# EAGLE design ProtoPi-v1 (EAGLE 7.3.0)
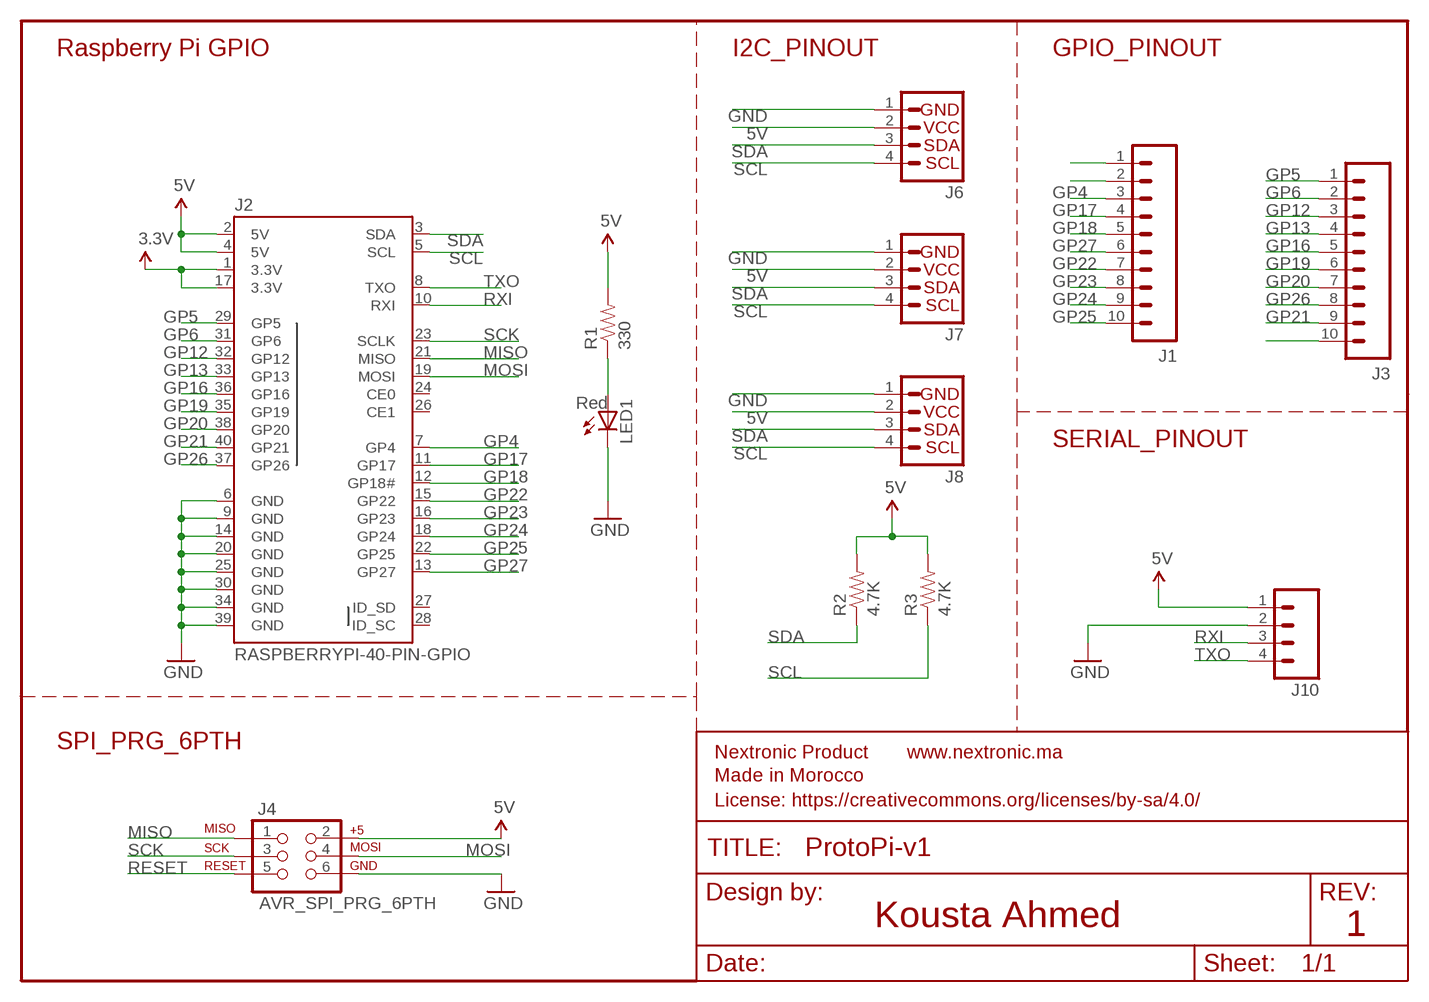
[diagram p0: schematic, sheet 1]

## Parts
FRAME1  FRAME-LETTER  [CREATIVE_COMMONS]
J1  M10SILK_FEMALE_PTH  [1X10]
J2  RASPBERRYPI-40-PIN-GPIO  [2X20-SHROUDED]
J3  M10SILK_FEMALE_PTH  [1X10]
J4  AVR_SPI_PRG_6PTH  [2X3]
J6  I2C_STANDARD  [1X04]
J7  I2C_STANDARD  [1X04]
J8  I2C_STANDARD  [1X04]
J10  M04PTH  [1X04]
LED1  Red  LED5MM  [LED5MM]
R1  330  RESISTORPTH1  [AXIAL-0.3]
R2  4.7K  RESISTORPTH1  [AXIAL-0.3]
R3  4.7K  RESISTORPTH1  [AXIAL-0.3]

## Nets
3.3V: J2.1(3.3V) J2.17(3.3V)
5V: J2.2(5V) J2.4(5V) J4.2 J6.2 J7.2 J8.2 J10.1 R1.P$2 R2.P$2 R3.P$2
GND: J2.6(GND) J2.9(GND) J2.14(GND) J2.20(GND) J2.25(GND) J2.30(GND) J2.34(GND) J2.39(GND) J4.6 J6.1 J7.1 J8.1 J10.2 LED1.K(C)
GP4: J1.3 J2.7(GP4)
GP5: J2.29(GP5) J3.1
GP6: J2.31(GP6) J3.2
GP12: J2.32(GP12) J3.3
GP13: J2.33(GP13) J3.4
GP16: J2.36(GP16) J3.5
GP17: J1.4 J2.11(GP17)
GP18: J1.5 J2.12(GP18#)
GP19: J2.35(GP19) J3.6
GP20: J2.38(GP20) J3.7
GP21: J2.40(GP21) J3.9
GP22: J1.7 J2.15(GP22)
GP23: J1.8 J2.16(GP23)
GP24: J1.9 J2.18(GP24)
GP25: J1.10 J2.22(GP25)
GP26: J2.37(GP26) J3.8
GP27: J1.6 J2.13(GP27)
MISO: J2.21(MISO) J4.1
MOSI: J2.19(MOSI) J4.4
N$4: J1.1
N$5: J1.2
N$126: LED1.A R1.P$1
N$468: J3.10
RESET: J4.5
RXI: J2.10(RXI) J10.3
SCK: J2.23(SCLK) J4.3
SCL: J2.5(SCL) J6.4 J7.4 J8.4 R3.P$1
SDA: J2.3(SDA) J6.3 J7.3 J8.3 R2.P$1
TXO: J2.8(TXO) J10.4
Unconnected: J2.24(CE0) J2.26(CE1) J2.27(ID_SD) J2.28(ID_SC)

## Notes on the sheet
- Raspberry Pi GPIO | I2C_PINOUT | GPIO_PINOUT
- SERIAL_PINOUT
- SPI_PRG_6PTH
- Kousta Ahmed | 1

## Library data of the parts
FRAME1 = SparkFun-Aesthetics:FRAME-LETTER: Schematic Frame Standard 8.5x11 US Letter frame
J1 J3 = SparkFun-Connectors:M10: Header 10 Standard 10-pin 0.1" header. Use with straight break away headers (SKU : PRT-00116), right angle break away headers (PRT-00553), swiss pins (PRT-00743), machine pins (PRT-00117), and female headers (PRT-00115).; PROD_ID: CONN-11563
J2 = SparkFun-Boards:RASPBERRYPI-40-PIN-GPIO: Second Generation Raspberry Pi GPIO Header 2x20 pin connector, as found on B, B+, A+ models.
J4 = SparkFun-Connectors:AVR_SPI_PRG_6: AVR ISP 6 Pin This is the reduced ISP connector for AVR programming. Common on Arduino. This footprint will take up less PCB space and can be used with a 10-pin to 6-pin adapter such as SKU: BOB-08508 **Special note about "TEST_POINT" package. The stop mask is on the top side, so if you want your programming test points to be on the bottom of your board, make sure to place this package on the bottom side of the board. This also ensure that the orientation to program from the bottom side will be correct.
J6-J8 = SparkFun-Connectors:I2C_STANDARD: SparkFun has standardized on a pinout for all I2C based sensor breakouts. This pinout allows I2C boards to be plugged directly into the headers on Arduino Uno compatible boards, and to be daisy chained easily.
J10 = SparkFun-Connectors:M04: Header 4 Standard 4-pin 0.1" header. Use with straight break away headers (SKU : PRT-00116), right angle break away headers (PRT-00553), swiss pins (PRT-00743), machine pins (PRT-00117), and female headers (PRT-00115). Molex polarized connector foot print use with SKU : PRT-08231 with associated crimp pins and housings. 1MM SMD Version SKU: PRT-10208; PROD_ID: CONN-09696
LED1 = SparkFun:LED: LEDs Standard schematic elements and footprints for 5mm, 3mm, 1206, and 0603 sized LEDs. 5mm - Spark Fun Electronics SKU : COM-00529 (and others)
R1-R3 = SparkFun:RESISTOR: Resistor Basic schematic elements and footprints for 0603, 1206, and PTH 1/10th watt (small) resistors.

## Board
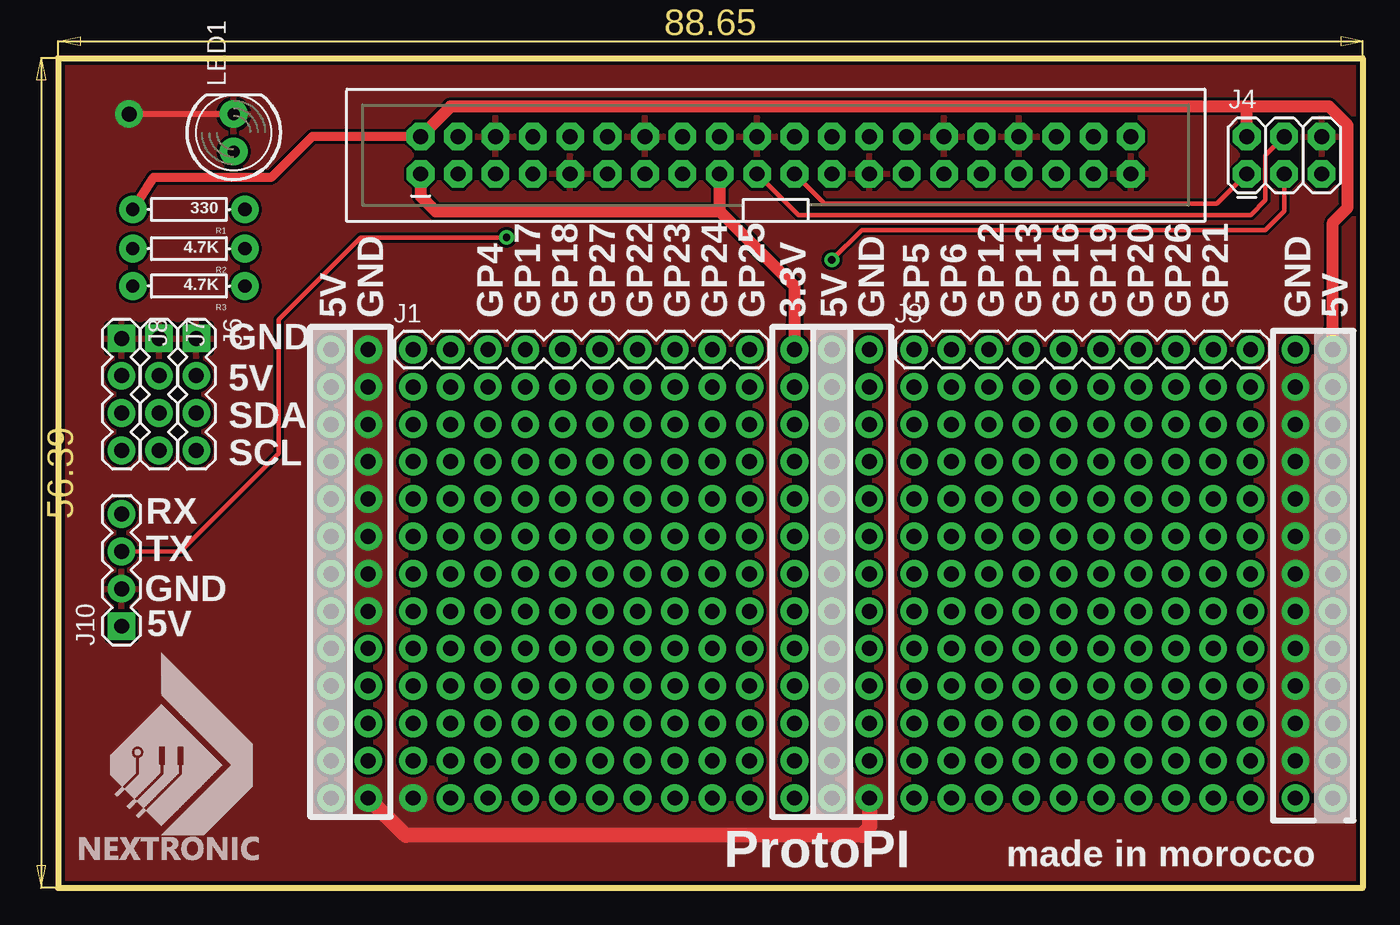
[diagram p1: board, top side]
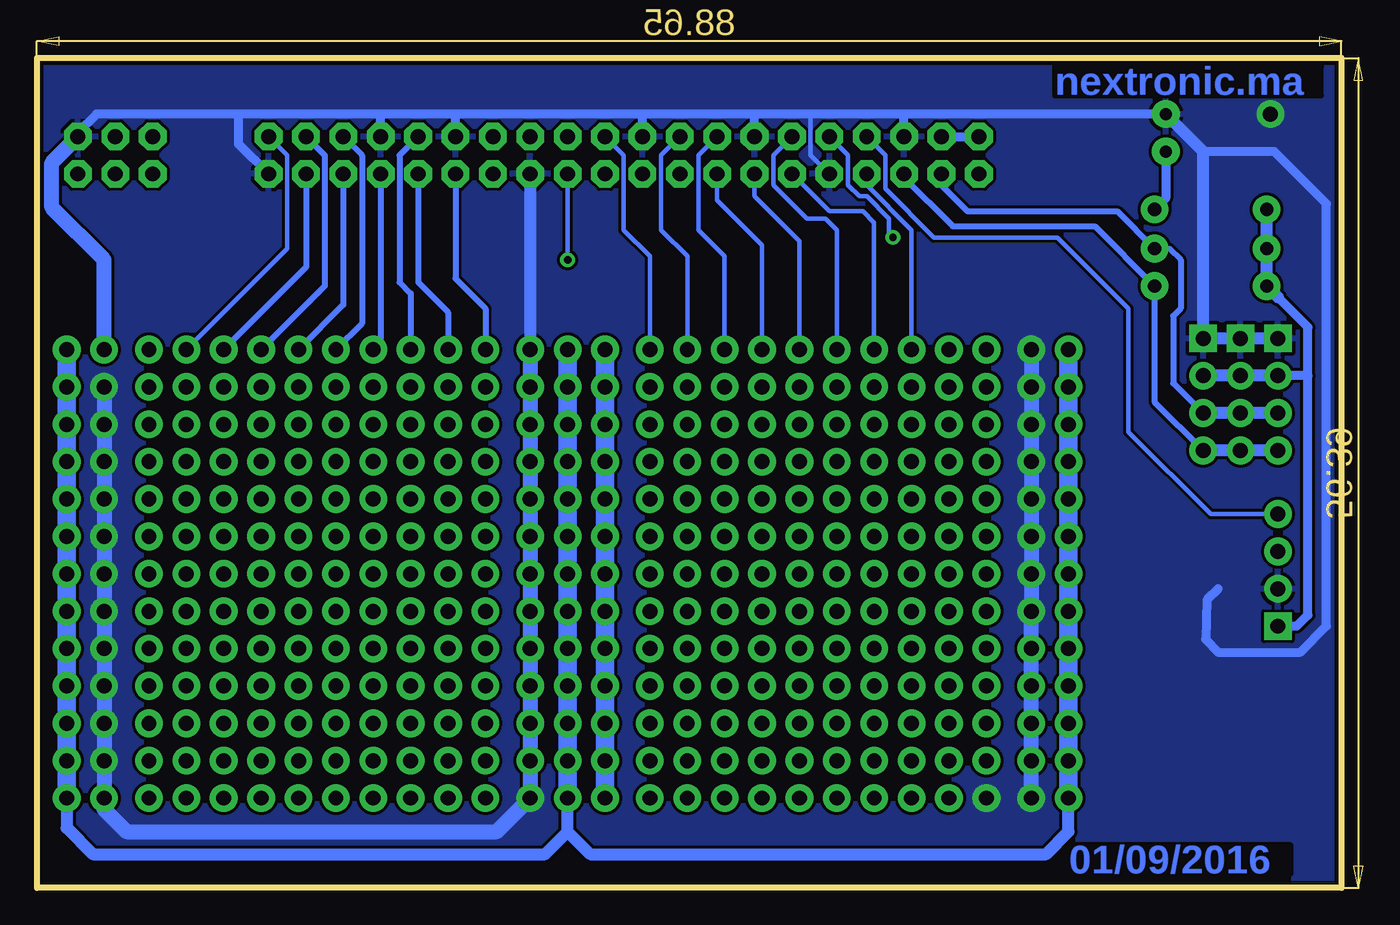
[diagram p2: board, bottom side, seen from below]

Size 88.65 x 56.39 mm. Coordinates in mm from the lower left corner, seen from the top.
Outline: 0,56.39 88.65,56.39 88.65,0 0,0 0,56.39
Copper layers (1*16): Top 0.035mm / dielectric 1.5mm / Bottom 0.035mm
Design rules "SparkFun": minimum track width 8mil, minimum drill 20mil, track to track 8mil, track to pad 8mil, pad to pad 8mil, via to via 8mil, smd to smd 8mil, copper to edge 10mil, drill to drill 8mil, minimum pad ring 12mil, minimum via ring 10mil, stop-mask expansion 4mil, vias tented up to drill 25mil, thermal gap 10mil

### Footprints (pad centres in the part's own frame; a part is rotated, then mirrored left to right if it is on the bottom)
1X10 = drill 1.016 pad 1.88: 1 0,0; 2 2.54,0; 3 5.08,0; 4 7.62,0; 5 10.16,0; 6 12.7,0; 7 15.24,0; 8 17.78,0; 9 20.32,0; 10 22.86,0
2X20-SHROUDED = drill 1.016 pad 1.88 octagon: 1 -1.27,24.13; 2 1.27,24.13; 3 -1.27,21.59; 4 1.27,21.59; 5 -1.27,19.05; 6 1.27,19.05; 7 -1.27,16.51; 8 1.27,16.51; 9 -1.27,13.97; 10 1.27,13.97; 11 -1.27,11.43; 12 1.27,11.43; 13 -1.27,8.89; 14 1.27,8.89; 15 -1.27,6.35; 16 1.27,6.35; 17 -1.27,3.81; 18 1.27,3.81; 19 -1.27,1.27; 20 1.27,1.27; 21 -1.27,-1.27; 22 1.27,-1.27; 23 -1.27,-3.81; 24 1.27,-3.81; 25 -1.27,-6.35; 26 1.27,-6.35; 27 -1.27,-8.89; 28 1.27,-8.89; 29 -1.27,-11.43; 30 1.27,-11.43; 31 -1.27,-13.97; 32 1.27,-13.97; 33 -1.27,-16.51; 34 1.27,-16.51; 35 -1.27,-19.05; 36 1.27,-19.05; 37 -1.27,-21.59; 38 1.27,-21.59; 39 -1.27,-24.13; 40 1.27,-24.13
2X3 = drill 1.016 pad 1.88 octagon: 1 0,0; 2 0,2.54; 3 2.54,0; 4 2.54,2.54; 5 5.08,0; 6 5.08,2.54
1X04 = drill 1.016 pad 1.88 square: 1 0,0 | drill 1.016 pad 1.88: 2 2.54,0; 3 5.08,0; 4 7.62,0
LED5MM = drill 0.813 pad 1.88: A -1.27,0; K 1.27,0
AXIAL-0.3 = drill 0.9 pad 1.88: P$1 -3.81,0; P$2 3.81,0

### Placement (x,y rotation side)
FRAME1  -0.25,-0.25 0 top
J1  24.13,36.58 0 top
J2  48.77,49.78 90 top
J3  58.17,36.58 0 top
J4  80.77,48.51 0 top
J6  9.4,37.34 270 top
J7  6.86,37.34 270 top
J8  4.32,37.34 270 top
J10  4.32,17.78 90 top
LED1  11.94,51.31 90 top
R1  8.89,46.1 180 top
R2  8.89,43.43 180 top
R3  8.89,40.89 180 top

### Tracks (layer width: path | path; a pad name or v marks a point on that pad's centre or on a via)
3.3V
  Top 0.813: J2.17 44.96,45.97 | 44.96,45.97 50.04,40.89 50.04,36.58 | J2.1 24.64,46.99 25.65,45.97 44.96,45.97
5V
  Top 0.61: J2.2 17.27,51.05 14.48,48.26 6.48,48.26 R1.P$2
  Top 0.813: J2.2 26.67,53.09 80.77,53.09 J4.2
  Bottom 0.61: J2.4 J2.2 | 2.29,34.8 J8.2 | 4.32,40.13 2.29,38.1 2.29,34.8 | J10.1 3.05,17.78 2.29,18.54 2.29,34.8
  Bottom 0.813: J8.2 J7.2 J6.2 | 4.32,40.13 R3.P$2 R2.P$2 R1.P$2
GND  (via drill 1.02 pad 1.88)
  Top 0.406: LED1.K 5.08,52.58 4.83,52.83
  Top 1.016: v55.12,6.1 55.12,4.06 54.61,3.56 23.62,3.56 v21.08,6.1
  Bottom 0.305: J2.9 36.07,49.78 36.07,52.58
  Bottom 0.61: 29.72,51.56 J2.6 29.72,52.58 | J2.39 74.93,50.55 74.93,52.58 | 74.93,52.58 84.58,52.58 85.85,51.31 J4.6 | LED1.K 29.72,52.58 | 29.72,52.58 36.07,52.58 39.88,52.58 | 39.88,52.58 47.5,52.58 | 47.5,52.58 60.2,52.58 | 60.2,52.58 65.28,52.58 | 65.28,52.58 74.93,52.58 | J2.14 39.88,52.58 | J2.20 47.5,52.58 | J2.34 65.28,52.58 | J2.30 60.2,52.58 | 8.38,20.32 9.14,19.56 9.23,16.89 8.38,16 2.79,16 1.02,17.78 1.02,46.48 4.57,50.04 9.14,50.04 9.4,49.78
  Bottom 0.813: J2.25 55.12,36.58 | J8.1 J7.1 J6.1 9.4,49.78 9.4,50.04 LED1.K
  Bottom 1.016: v84.07,34.04 v84.07,31.5 v84.07,28.96 v84.07,26.42 v84.07,23.88 v84.07,21.34 v84.07,18.8 v84.07,16.26 v84.07,13.72 v84.07,11.18 v84.07,8.64 84.07,5.33 82.55,3.81 57.4,3.81 v55.12,6.1 | v21.08,36.58 v21.08,34.04 v21.08,31.5 v21.08,28.96 v21.08,26.42 v21.08,23.88 v21.08,21.34 v21.08,18.8 v21.08,6.1
  other vias: 4.83,52.58 24.13,6.1
  pour Bottom: 0,56.39 88.65,56.39 88.65,0 0,0
  pour Top: 0,56.39 88.65,56.39 88.65,0 0,0
GP4
  Bottom 0.305: J2.7 32.26,47.75 29.21,44.7 J1.3
GP5
  Bottom 0.406: J2.29 60.2,41.4 58.17,39.37 J3.1
GP6
  Bottom 0.406: J2.31 62.74,41.15 60.71,39.12 J3.2
GP12
  Bottom 0.406: J2.32 64.01,49.78 64.01,41.15 63.25,40.39 J3.3
GP13
  Bottom 0.406: J2.33 65.28,37.08 J3.4
GP16
  Bottom 0.406: J2.36 66.55,49.78 66.55,38.35 J3.5
GP17
  Bottom 0.305: J1.4 31.75,45.21 32.51,45.97 34.8,45.97 J2.11
GP18
  Bottom 0.305: J2.12 38.61,49.78 38.61,47.75 36.32,45.47 35.05,45.47 34.29,44.7 J1.5
GP19
  Bottom 0.406: J2.35 67.82,39.62 J3.6
GP20
  Bottom 0.406: J2.38 69.09,49.78 69.09,40.89 J3.7
GP21
  Bottom 0.305: J2.40 71.63,49.78 71.63,43.43 J3.9
GP22
  Bottom 0.305: J1.7 39.37,43.69 42.42,46.74 J2.15
GP23
  Bottom 0.305: J1.8 41.91,42.93 43.69,44.7 43.69,49.78 J2.16
GP24
  Bottom 0.305: J1.9 44.45,42.93 46.23,44.7 46.23,49.78 J2.18
GP25
  Bottom 0.305: J2.22 48.77,49.78 48.77,44.7 46.99,42.93 J1.10
GP26
  Bottom 0.406: J2.37 70.36,42.16 J3.8
GP27
  Bottom 0.305: J1.6 36.83,43.94 39.88,46.99 J2.13
MISO
  Top 0.305: J2.21 52.07,46.48 78.74,46.48 J4.1
MOSI
  Top 0.305: J4.4 82.04,49.78 82.04,46.74 81.03,45.72 50.29,45.72 J2.19
N$2  (via drill 1.02 pad 1.88)
  other vias: 24.13,31.5
N$3  (via drill 1.02 pad 1.88)
  other vias: 24.13,34.04
N$6  (via drill 1.02 pad 1.88)
  other vias: 26.67,34.04
N$7  (via drill 1.02 pad 1.88)
  other vias: 26.67,31.5
N$8  (via drill 1.02 pad 1.88)
  other vias: 26.67,28.96
N$9  (via drill 1.02 pad 1.88)
  other vias: 26.67,26.42
N$10  (via drill 1.02 pad 1.88)
  other vias: 26.67,23.88
N$11  (via drill 1.02 pad 1.88)
  other vias: 26.67,21.34
N$13  (via drill 1.02 pad 1.88)
  other vias: 26.67,18.8
N$14  (via drill 1.02 pad 1.88)
  other vias: 26.67,13.72
N$15  (via drill 1.02 pad 1.88)
  other vias: 26.67,16.26
N$16  (via drill 1.02 pad 1.88)
  other vias: 24.13,13.72
N$17  (via drill 1.02 pad 1.88)
  other vias: 24.13,16.26
N$18  (via drill 1.02 pad 1.88)
  other vias: 24.13,21.34
N$19  (via drill 1.02 pad 1.88)
  other vias: 24.13,18.8
N$20  (via drill 1.02 pad 1.88)
  other vias: 24.13,23.88
N$21  (via drill 1.02 pad 1.88)
  other vias: 24.13,26.42
N$22  (via drill 1.02 pad 1.88)
  other vias: 24.13,28.96
N$23  (via drill 1.02 pad 1.88)
  other vias: 18.54,31.5
N$24  (via drill 1.02 pad 1.88)
  other vias: 18.54,34.04
N$25  (via drill 1.02 pad 1.88)
  Bottom 1.27: v18.54,36.58 18.54,6.1
N$34  (via drill 1.02 pad 1.88)
  other vias: 21.08,13.72
N$35  (via drill 1.02 pad 1.88)
  other vias: 21.08,16.26
N$36  (via drill 1.02 pad 1.88)
  other vias: 18.54,13.72
N$37  (via drill 1.02 pad 1.88)
  other vias: 18.54,16.26
N$38  (via drill 1.02 pad 1.88)
  other vias: 18.54,21.34
N$39  (via drill 1.02 pad 1.88)
  other vias: 18.54,18.8
N$40  (via drill 1.02 pad 1.88)
  other vias: 18.54,23.88
N$41  (via drill 1.02 pad 1.88)
  other vias: 18.54,26.42
N$42  (via drill 1.02 pad 1.88)
  other vias: 18.54,28.96
N$43  (via drill 1.02 pad 1.88)
  other vias: 18.54,6.1
N$44  (via drill 1.02 pad 1.88)
  other vias: 18.54,8.64
N$45  (via drill 1.02 pad 1.88)
  other vias: 18.54,11.18
N$46  (via drill 1.02 pad 1.88)
  other vias: 21.08,11.18
N$47  (via drill 1.02 pad 1.88)
  other vias: 21.08,8.64
N$49  (via drill 1.02 pad 1.88)
  other vias: 86.61,11.18
N$60  (via drill 1.02 pad 1.88)
  other vias: 86.61,8.64
N$61  (via drill 1.02 pad 1.88)
  Bottom 0.813: v86.61,6.1 86.61,4.06 84.84,2.29 54.1,2.29 52.58,3.81 | 52.58,3.81 52.58,6.1 | 52.58,3.81 51.05,2.29 20.07,2.29 18.54,3.81 18.54,6.1
  Bottom 1.27: v86.61,6.1 86.61,36.58
N$72  (via drill 1.02 pad 1.88)
  other vias: 84.07,6.1
N$125  (via drill 1.02 pad 1.88)
  other vias: 86.61,28.96
N$126
  Bottom 0.61: LED1.A 11.94,46.86 R1.P$1
N$127  (via drill 1.02 pad 1.88)
  other vias: 86.61,26.42
N$135  (via drill 1.02 pad 1.88)
  other vias: 86.61,21.34
N$138  (via drill 1.02 pad 1.88)
  other vias: 86.61,23.88
N$149  (via drill 1.02 pad 1.88)
  other vias: 86.61,18.8
N$150  (via drill 1.02 pad 1.88)
  other vias: 86.61,16.26
N$161  (via drill 1.02 pad 1.88)
  other vias: 86.61,13.72
N$166  (via drill 1.02 pad 1.88)
  Top 0.813: v86.61,36.58 86.61,45.21 87.63,46.23 87.63,51.82 86.36,53.09 78.99,53.09
N$177  (via drill 1.02 pad 1.88)
  other vias: 86.61,34.04
N$178  (via drill 1.02 pad 1.88)
  other vias: 86.61,31.5
N$205  (via drill 1.02 pad 1.88)
  Bottom 1.016: v84.07,36.58 84.07,42.67 87.63,46.23 87.63,49.28 85.85,51.05
N$206  (via drill 1.02 pad 1.88)
  other vias: 52.58,31.5
N$217  (via drill 1.02 pad 1.88)
  other vias: 52.58,34.04
N$222  (via drill 1.02 pad 1.88)
  Bottom 1.27: v52.58,36.58 52.58,6.1
N$233  (via drill 1.02 pad 1.88)
  Bottom 1.016: v55.12,36.58 55.12,6.1
N$234  (via drill 1.02 pad 1.88)
  other vias: 55.12,34.04
N$245  (via drill 1.02 pad 1.88)
  other vias: 55.12,31.5
N$250  (via drill 1.02 pad 1.88)
  other vias: 55.12,28.96
N$261  (via drill 1.02 pad 1.88)
  other vias: 55.12,26.42
N$262  (via drill 1.02 pad 1.88)
  other vias: 55.12,23.88
N$273  (via drill 1.02 pad 1.88)
  other vias: 55.12,21.34
N$278  (via drill 1.02 pad 1.88)
  other vias: 55.12,18.8
N$289  (via drill 1.02 pad 1.88)
  other vias: 55.12,13.72
N$290  (via drill 1.02 pad 1.88)
  other vias: 55.12,16.26
N$291  (via drill 1.02 pad 1.88)
  other vias: 52.58,13.72
N$301  (via drill 1.02 pad 1.88)
  other vias: 52.58,16.26
N$306  (via drill 1.02 pad 1.88)
  other vias: 52.58,21.34
N$314  (via drill 1.02 pad 1.88)
  other vias: 52.58,18.8
N$315  (via drill 1.02 pad 1.88)
  other vias: 52.58,23.88
N$316  (via drill 1.02 pad 1.88)
  other vias: 52.58,26.42
N$317  (via drill 1.02 pad 1.88)
  other vias: 52.58,28.96
N$318  (via drill 1.02 pad 1.88)
  other vias: 52.58,6.1
N$328  (via drill 1.02 pad 1.88)
  other vias: 52.58,8.64
N$339  (via drill 1.02 pad 1.88)
  other vias: 52.58,11.18
N$340  (via drill 1.02 pad 1.88)
  other vias: 55.12,11.18
N$341  (via drill 1.02 pad 1.88)
  other vias: 55.12,8.64
N$353  (via drill 1.02 pad 1.88)
  other vias: 46.99,16.26
N$356  (via drill 1.02 pad 1.88)
  other vias: 46.99,18.8
N$357  (via drill 1.02 pad 1.88)
  other vias: 46.99,21.34
N$358  (via drill 1.02 pad 1.88)
  Bottom 1.27: v50.04,36.58 50.04,6.1
N$359  (via drill 1.02 pad 1.88)
  other vias: 50.04,34.04
N$360  (via drill 1.02 pad 1.88)
  other vias: 50.04,31.5
N$361  (via drill 1.02 pad 1.88)
  other vias: 50.04,28.96
N$372  (via drill 1.02 pad 1.88)
  other vias: 50.04,26.42
N$373  (via drill 1.02 pad 1.88)
  other vias: 50.04,23.88
N$374  (via drill 1.02 pad 1.88)
  other vias: 50.04,21.34
N$375  (via drill 1.02 pad 1.88)
  other vias: 50.04,18.8
N$386  (via drill 1.02 pad 1.88)
  other vias: 50.04,13.72
N$387  (via drill 1.02 pad 1.88)
  other vias: 50.04,16.26
N$388  (via drill 1.02 pad 1.88)
  other vias: 46.99,23.88
N$389  (via drill 1.02 pad 1.88)
  other vias: 46.99,26.42
N$390  (via drill 1.02 pad 1.88)
  other vias: 46.99,28.96
N$391  (via drill 1.02 pad 1.88)
  other vias: 46.99,31.5
N$392  (via drill 1.02 pad 1.88)
  other vias: 46.99,34.04
N$395  (via drill 1.02 pad 1.88)
  other vias: 44.45,34.04
N$396  (via drill 1.02 pad 1.88)
  other vias: 44.45,31.5
N$397  (via drill 1.02 pad 1.88)
  other vias: 44.45,28.96
N$398  (via drill 1.02 pad 1.88)
  other vias: 50.04,11.18
N$399  (via drill 1.02 pad 1.88)
  other vias: 50.04,8.64
N$400  (via drill 1.02 pad 1.88)
  other vias: 50.04,6.1
N$401  (via drill 1.02 pad 1.88)
  other vias: 44.45,26.42
N$402  (via drill 1.02 pad 1.88)
  other vias: 44.45,21.34
N$403  (via drill 1.02 pad 1.88)
  other vias: 44.45,16.26
N$404  (via drill 1.02 pad 1.88)
  other vias: 44.45,18.8
N$405  (via drill 1.02 pad 1.88)
  other vias: 44.45,23.88
N$407  (via drill 1.02 pad 1.88)
  other vias: 41.91,34.04
N$408  (via drill 1.02 pad 1.88)
  other vias: 41.91,31.5
N$409  (via drill 1.02 pad 1.88)
  other vias: 41.91,28.96
N$410  (via drill 1.02 pad 1.88)
  other vias: 41.91,26.42
N$411  (via drill 1.02 pad 1.88)
  other vias: 41.91,23.88
N$412  (via drill 1.02 pad 1.88)
  other vias: 41.91,21.34
N$416  (via drill 1.02 pad 1.88)
  other vias: 41.91,18.8
N$417  (via drill 1.02 pad 1.88)
  other vias: 41.91,16.26
N$418  (via drill 1.02 pad 1.88)
  other vias: 41.91,13.72
N$419  (via drill 1.02 pad 1.88)
  other vias: 39.37,13.72
N$420  (via drill 1.02 pad 1.88)
  other vias: 39.37,16.26
N$421  (via drill 1.02 pad 1.88)
  other vias: 39.37,18.8
N$432  (via drill 1.02 pad 1.88)
  other vias: 39.37,21.34
N$433  (via drill 1.02 pad 1.88)
  other vias: 39.37,23.88
N$434  (via drill 1.02 pad 1.88)
  other vias: 39.37,26.42
N$435  (via drill 1.02 pad 1.88)
  other vias: 39.37,28.96
N$443  (via drill 1.02 pad 1.88)
  other vias: 39.37,31.5
N$444  (via drill 1.02 pad 1.88)
  other vias: 39.37,34.04
N$447  (via drill 1.02 pad 1.88)
  other vias: 36.83,34.04
N$448  (via drill 1.02 pad 1.88)
  other vias: 36.83,31.5
N$449  (via drill 1.02 pad 1.88)
  other vias: 36.83,28.96
N$450  (via drill 1.02 pad 1.88)
  other vias: 36.83,23.88
N$451  (via drill 1.02 pad 1.88)
  other vias: 36.83,26.42
N$452  (via drill 1.02 pad 1.88)
  other vias: 36.83,21.34
N$453  (via drill 1.02 pad 1.88)
  other vias: 36.83,18.8
N$454  (via drill 1.02 pad 1.88)
  other vias: 36.83,16.26
N$455  (via drill 1.02 pad 1.88)
  other vias: 36.83,13.72
N$456  (via drill 1.02 pad 1.88)
  other vias: 34.29,13.72
N$457  (via drill 1.02 pad 1.88)
  other vias: 34.29,16.26
N$458  (via drill 1.02 pad 1.88)
  other vias: 34.29,18.8
N$459  (via drill 1.02 pad 1.88)
  other vias: 34.29,21.34
N$460  (via drill 1.02 pad 1.88)
  other vias: 34.29,23.88
N$461  (via drill 1.02 pad 1.88)
  other vias: 34.29,26.42
N$462  (via drill 1.02 pad 1.88)
  other vias: 34.29,28.96
N$463  (via drill 1.02 pad 1.88)
  other vias: 34.29,31.5
N$464  (via drill 1.02 pad 1.88)
  other vias: 34.29,34.04
N$466  (via drill 1.02 pad 1.88)
  other vias: 29.21,31.5
N$467  (via drill 1.02 pad 1.88)
  other vias: 29.21,34.04
N$470  (via drill 1.02 pad 1.88)
  other vias: 31.75,34.04
N$471  (via drill 1.02 pad 1.88)
  other vias: 31.75,31.5
N$472  (via drill 1.02 pad 1.88)
  other vias: 31.75,28.96
N$473  (via drill 1.02 pad 1.88)
  other vias: 31.75,26.42
N$474  (via drill 1.02 pad 1.88)
  other vias: 31.75,23.88
N$475  (via drill 1.02 pad 1.88)
  other vias: 31.75,21.34
N$476  (via drill 1.02 pad 1.88)
  other vias: 31.75,18.8
N$477  (via drill 1.02 pad 1.88)
  other vias: 31.75,13.72
N$478  (via drill 1.02 pad 1.88)
  other vias: 31.75,16.26
N$479  (via drill 1.02 pad 1.88)
  other vias: 29.21,13.72
N$480  (via drill 1.02 pad 1.88)
  other vias: 29.21,16.26
N$481  (via drill 1.02 pad 1.88)
  other vias: 29.21,21.34
N$482  (via drill 1.02 pad 1.88)
  other vias: 29.21,18.8
N$483  (via drill 1.02 pad 1.88)
  other vias: 29.21,23.88
N$484  (via drill 1.02 pad 1.88)
  other vias: 29.21,26.42
N$485  (via drill 1.02 pad 1.88)
  other vias: 29.21,28.96
N$486  (via drill 1.02 pad 1.88)
  other vias: 44.45,13.72
N$487  (via drill 1.02 pad 1.88)
  other vias: 46.99,13.72
N$488  (via drill 1.02 pad 1.88)
  other vias: 58.17,31.5
N$489  (via drill 1.02 pad 1.88)
  other vias: 58.17,34.04
N$492  (via drill 1.02 pad 1.88)
  other vias: 60.71,34.04
N$493  (via drill 1.02 pad 1.88)
  other vias: 60.71,31.5
N$494  (via drill 1.02 pad 1.88)
  other vias: 60.71,28.96
N$495  (via drill 1.02 pad 1.88)
  other vias: 60.71,26.42
N$496  (via drill 1.02 pad 1.88)
  other vias: 60.71,23.88
N$497  (via drill 1.02 pad 1.88)
  other vias: 60.71,21.34
N$498  (via drill 1.02 pad 1.88)
  other vias: 60.71,18.8
N$499  (via drill 1.02 pad 1.88)
  other vias: 60.71,13.72
N$500  (via drill 1.02 pad 1.88)
  other vias: 60.71,16.26
N$501  (via drill 1.02 pad 1.88)
  other vias: 58.17,13.72
N$502  (via drill 1.02 pad 1.88)
  other vias: 58.17,16.26
N$503  (via drill 1.02 pad 1.88)
  other vias: 58.17,21.34
N$504  (via drill 1.02 pad 1.88)
  other vias: 58.17,18.8
N$505  (via drill 1.02 pad 1.88)
  other vias: 58.17,23.88
N$506  (via drill 1.02 pad 1.88)
  other vias: 58.17,26.42
N$507  (via drill 1.02 pad 1.88)
  other vias: 58.17,28.96
N$509  (via drill 1.02 pad 1.88)
  other vias: 24.13,8.64
N$510  (via drill 1.02 pad 1.88)
  other vias: 24.13,11.18
N$511  (via drill 1.02 pad 1.88)
  other vias: 26.67,11.18
N$512  (via drill 1.02 pad 1.88)
  other vias: 26.67,8.64
N$513  (via drill 1.02 pad 1.88)
  other vias: 26.67,6.1
N$514  (via drill 1.02 pad 1.88)
  other vias: 46.99,6.1
N$515  (via drill 1.02 pad 1.88)
  other vias: 46.99,8.64
N$516  (via drill 1.02 pad 1.88)
  other vias: 46.99,11.18
N$518  (via drill 1.02 pad 1.88)
  other vias: 78.49,34.04
N$519  (via drill 1.02 pad 1.88)
  other vias: 78.49,31.5
N$520  (via drill 1.02 pad 1.88)
  other vias: 78.49,28.96
N$521  (via drill 1.02 pad 1.88)
  other vias: 78.49,26.42
N$522  (via drill 1.02 pad 1.88)
  other vias: 78.49,21.34
N$523  (via drill 1.02 pad 1.88)
  other vias: 78.49,16.26
N$524  (via drill 1.02 pad 1.88)
  other vias: 78.49,18.8
N$525  (via drill 1.02 pad 1.88)
  other vias: 78.49,23.88
N$527  (via drill 1.02 pad 1.88)
  other vias: 75.95,34.04
N$528  (via drill 1.02 pad 1.88)
  other vias: 75.95,31.5
N$529  (via drill 1.02 pad 1.88)
  other vias: 75.95,28.96
N$530  (via drill 1.02 pad 1.88)
  other vias: 75.95,26.42
N$531  (via drill 1.02 pad 1.88)
  other vias: 75.95,23.88
N$532  (via drill 1.02 pad 1.88)
  other vias: 75.95,21.34
N$533  (via drill 1.02 pad 1.88)
  other vias: 75.95,18.8
N$534  (via drill 1.02 pad 1.88)
  other vias: 75.95,16.26
N$535  (via drill 1.02 pad 1.88)
  other vias: 75.95,13.72
N$536  (via drill 1.02 pad 1.88)
  other vias: 73.41,13.72
N$537  (via drill 1.02 pad 1.88)
  other vias: 73.41,16.26
N$538  (via drill 1.02 pad 1.88)
  other vias: 73.41,18.8
N$539  (via drill 1.02 pad 1.88)
  other vias: 73.41,21.34
N$540  (via drill 1.02 pad 1.88)
  other vias: 73.41,23.88
N$541  (via drill 1.02 pad 1.88)
  other vias: 73.41,26.42
N$542  (via drill 1.02 pad 1.88)
  other vias: 73.41,28.96
N$543  (via drill 1.02 pad 1.88)
  other vias: 73.41,31.5
N$544  (via drill 1.02 pad 1.88)
  other vias: 73.41,34.04
N$547  (via drill 1.02 pad 1.88)
  other vias: 70.87,34.04
N$548  (via drill 1.02 pad 1.88)
  other vias: 70.87,31.5
N$549  (via drill 1.02 pad 1.88)
  other vias: 70.87,28.96
N$550  (via drill 1.02 pad 1.88)
  other vias: 70.87,23.88
N$551  (via drill 1.02 pad 1.88)
  other vias: 70.87,26.42
N$552  (via drill 1.02 pad 1.88)
  other vias: 70.87,21.34
N$553  (via drill 1.02 pad 1.88)
  other vias: 70.87,18.8
N$554  (via drill 1.02 pad 1.88)
  other vias: 70.87,16.26
N$555  (via drill 1.02 pad 1.88)
  other vias: 70.87,13.72
N$556  (via drill 1.02 pad 1.88)
  other vias: 68.33,13.72
N$557  (via drill 1.02 pad 1.88)
  other vias: 68.33,16.26
N$558  (via drill 1.02 pad 1.88)
  other vias: 68.33,18.8
N$559  (via drill 1.02 pad 1.88)
  other vias: 68.33,21.34
N$560  (via drill 1.02 pad 1.88)
  other vias: 68.33,23.88
N$561  (via drill 1.02 pad 1.88)
  other vias: 68.33,26.42
N$562  (via drill 1.02 pad 1.88)
  other vias: 68.33,28.96
N$563  (via drill 1.02 pad 1.88)
  other vias: 68.33,31.5
N$564  (via drill 1.02 pad 1.88)
  other vias: 68.33,34.04
N$566  (via drill 1.02 pad 1.88)
  other vias: 63.25,31.5
N$567  (via drill 1.02 pad 1.88)
  other vias: 63.25,34.04
N$570  (via drill 1.02 pad 1.88)
  other vias: 65.79,34.04
N$571  (via drill 1.02 pad 1.88)
  other vias: 65.79,31.5
N$572  (via drill 1.02 pad 1.88)
  other vias: 65.79,28.96
N$573  (via drill 1.02 pad 1.88)
  other vias: 65.79,26.42
N$574  (via drill 1.02 pad 1.88)
  other vias: 65.79,23.88
N$575  (via drill 1.02 pad 1.88)
  other vias: 65.79,21.34
N$576  (via drill 1.02 pad 1.88)
  other vias: 65.79,18.8
N$577  (via drill 1.02 pad 1.88)
  other vias: 65.79,13.72
N$578  (via drill 1.02 pad 1.88)
  other vias: 65.79,16.26
N$579  (via drill 1.02 pad 1.88)
  other vias: 63.25,13.72
N$580  (via drill 1.02 pad 1.88)
  other vias: 63.25,16.26
N$581  (via drill 1.02 pad 1.88)
  other vias: 63.25,21.34
N$582  (via drill 1.02 pad 1.88)
  other vias: 63.25,18.8
N$583  (via drill 1.02 pad 1.88)
  other vias: 63.25,23.88
N$584  (via drill 1.02 pad 1.88)
  other vias: 63.25,26.42
N$585  (via drill 1.02 pad 1.88)
  other vias: 63.25,28.96
N$586  (via drill 1.02 pad 1.88)
  other vias: 78.49,13.72
N$587  (via drill 1.02 pad 1.88)
  other vias: 44.45,11.18
N$588  (via drill 1.02 pad 1.88)
  other vias: 44.45,8.64
N$589  (via drill 1.02 pad 1.88)
  other vias: 44.45,6.1
N$590  (via drill 1.02 pad 1.88)
  other vias: 41.91,11.18
N$591  (via drill 1.02 pad 1.88)
  other vias: 41.91,8.64
N$592  (via drill 1.02 pad 1.88)
  other vias: 41.91,6.1
N$593  (via drill 1.02 pad 1.88)
  other vias: 39.37,6.1
N$594  (via drill 1.02 pad 1.88)
  other vias: 39.37,8.64
N$595  (via drill 1.02 pad 1.88)
  other vias: 39.37,11.18
N$596  (via drill 1.02 pad 1.88)
  other vias: 36.83,11.18
N$597  (via drill 1.02 pad 1.88)
  other vias: 36.83,8.64
N$598  (via drill 1.02 pad 1.88)
  other vias: 36.83,6.1
N$599  (via drill 1.02 pad 1.88)
  other vias: 34.29,6.1
N$600  (via drill 1.02 pad 1.88)
  other vias: 34.29,8.64
N$601  (via drill 1.02 pad 1.88)
  other vias: 34.29,11.18
N$602  (via drill 1.02 pad 1.88)
  other vias: 29.21,6.1
N$603  (via drill 1.02 pad 1.88)
  other vias: 29.21,8.64
N$604  (via drill 1.02 pad 1.88)
  other vias: 29.21,11.18
N$605  (via drill 1.02 pad 1.88)
  other vias: 31.75,11.18
N$606  (via drill 1.02 pad 1.88)
  other vias: 31.75,8.64
N$607  (via drill 1.02 pad 1.88)
  other vias: 31.75,6.1
N$608  (via drill 1.02 pad 1.88)
  other vias: 58.17,6.1
N$609  (via drill 1.02 pad 1.88)
  other vias: 58.17,8.64
N$610  (via drill 1.02 pad 1.88)
  other vias: 58.17,11.18
N$611  (via drill 1.02 pad 1.88)
  other vias: 60.71,11.18
N$612  (via drill 1.02 pad 1.88)
  other vias: 60.71,8.64
N$613  (via drill 1.02 pad 1.88)
  other vias: 60.71,6.1
N$615  (via drill 1.02 pad 1.88)
  other vias: 81.03,34.04
N$616  (via drill 1.02 pad 1.88)
  other vias: 81.03,31.5
N$617  (via drill 1.02 pad 1.88)
  other vias: 78.49,11.18
N$618  (via drill 1.02 pad 1.88)
  other vias: 78.49,8.64
N$619  (via drill 1.02 pad 1.88)
  other vias: 78.49,6.1
N$620  (via drill 1.02 pad 1.88)
  other vias: 75.95,11.18
N$621  (via drill 1.02 pad 1.88)
  other vias: 75.95,8.64
N$622  (via drill 1.02 pad 1.88)
  other vias: 75.95,6.1
N$623  (via drill 1.02 pad 1.88)
  other vias: 73.41,6.1
N$624  (via drill 1.02 pad 1.88)
  other vias: 73.41,8.64
N$625  (via drill 1.02 pad 1.88)
  other vias: 73.41,11.18
N$626  (via drill 1.02 pad 1.88)
  other vias: 70.87,11.18
N$627  (via drill 1.02 pad 1.88)
  other vias: 70.87,8.64
N$628  (via drill 1.02 pad 1.88)
  other vias: 70.87,6.1
N$629  (via drill 1.02 pad 1.88)
  other vias: 68.33,6.1
N$630  (via drill 1.02 pad 1.88)
  other vias: 68.33,8.64
N$631  (via drill 1.02 pad 1.88)
  other vias: 68.33,11.18
N$632  (via drill 1.02 pad 1.88)
  other vias: 63.25,6.1
N$633  (via drill 1.02 pad 1.88)
  other vias: 63.25,8.64
N$634  (via drill 1.02 pad 1.88)
  other vias: 63.25,11.18
N$635  (via drill 1.02 pad 1.88)
  other vias: 65.79,11.18
N$636  (via drill 1.02 pad 1.88)
  other vias: 65.79,8.64
N$637  (via drill 1.02 pad 1.88)
  other vias: 65.79,6.1
N$638  (via drill 1.02 pad 1.88)
  other vias: 81.03,28.96
N$639  (via drill 1.02 pad 1.88)
  other vias: 81.03,26.42
N$640  (via drill 1.02 pad 1.88)
  other vias: 81.03,21.34
N$641  (via drill 1.02 pad 1.88)
  other vias: 81.03,16.26
N$642  (via drill 1.02 pad 1.88)
  other vias: 81.03,18.8
N$643  (via drill 1.02 pad 1.88)
  other vias: 81.03,23.88
N$644  (via drill 1.02 pad 1.88)
  other vias: 81.03,13.72
N$645  (via drill 1.02 pad 1.88)
  other vias: 81.03,11.18
N$646  (via drill 1.02 pad 1.88)
  other vias: 81.03,8.64
N$647  (via drill 1.02 pad 1.88)
  other vias: 81.03,6.1
RXI  (via drill 0.5)
  Top 0.305: v30.48,44.2 20.57,44.2 14.99,38.61 14.99,29.5 8.35,22.86 J10.3
  Bottom 0.305: J2.10 33.53,49.78 33.53,47.75 32.77,46.99 32.26,46.99 30.73,45.47 30.73,44.45 v30.48,44.2
SCK  (via drill 0.5)
  Top 0.305: J4.3 83.31,45.97 82.04,44.7 54.61,44.7 v52.58,42.67
  Bottom 0.305: J2.23 v52.58,42.67
SCL
  Bottom 0.406: J6.4 12.7,33.02 R3.P$1 16.76,44.96 26.42,44.96 29.72,48.26 J2.5
  Bottom 0.813: J8.4 J7.4 J6.4
SDA
  Bottom 0.406: J6.3 11.43,34.29 11.43,38.86 10.92,39.37 10.92,42.67 11.68,43.43 R2.P$1 15.24,45.97 25.4,45.97 27.18,47.75 J2.3
  Bottom 0.813: J8.3 J7.3 J6.3
TXO
  Bottom 0.305: J2.8 30.99,49.78 30.99,47.5 27.69,44.2 19.3,44.2 14.48,39.37 14.48,30.99 8.89,25.4 J10.4

### Text on the board
Bottom: nextronic.ma | 01/09/2016
tPlace: 5V | GND | GP4 | GP17 | GP18 | GP27 | GP22 | GP23 | GP24 | GP25 | 3.3V | 5V | GND | GP5 | GP6 | GP12 | GP13 | GP16 | GP19 | GP20 | GP26 | GP21 | GND | 5V | GND | 5V | SDA | SCL | RX | TX | GND | 5V | ProtoPI | made in morocco